# Altium project amplifier.PrjPCB
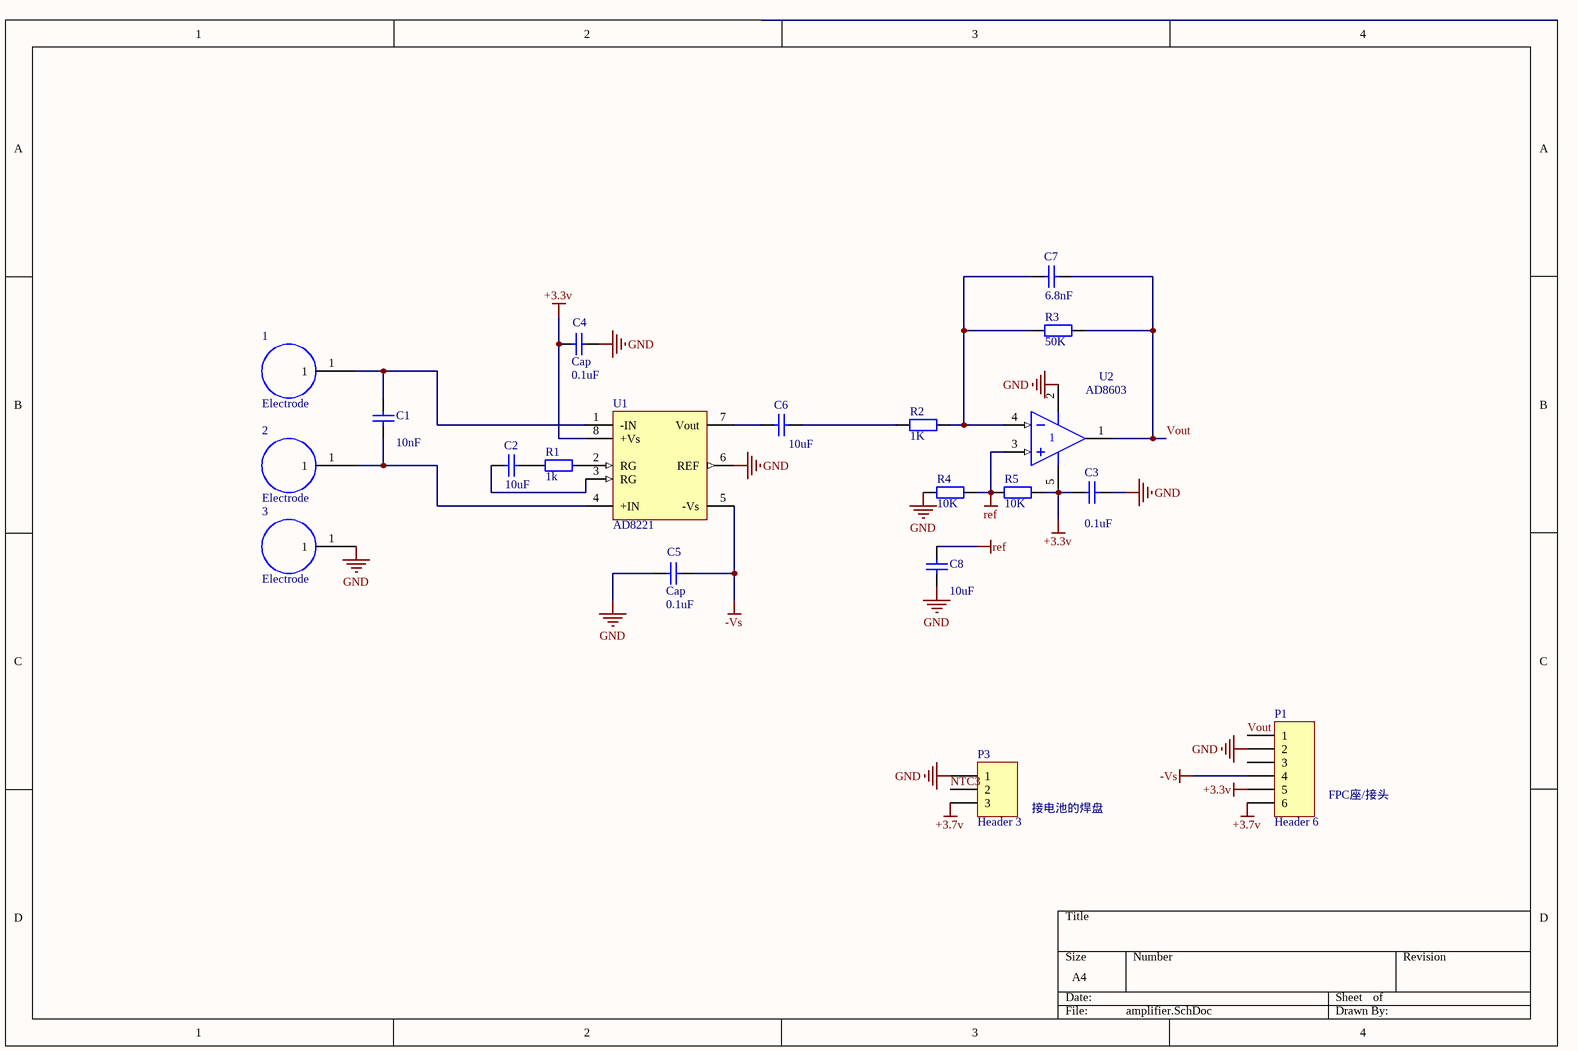
[diagram p0: amplifier.SchDoc]
1 sheet, 20 parts. Net scope: global (net labels, ports and power ports of the same name join across sheets).
Board file: amplifier.PcbDoc

## Sheet amplifier.SchDoc
size A4

### Parts
1  Electrode  [elec-diff]
2  Electrode  [elec-diff]
3  Electrode  [elec-ref]
C1  value 10nF  [1608[0603]]
C2  value 10uF  [1608[0603]]
C3  value 0.1uF  [1608[0603]]
C4  Cap  value 0.1uF  [1608[0603]]
C5  Cap  value 0.1uF  [1608[0603]]
C6  value 10uF  [1608[0603]]
C7  value 6.8nF  [1608[0603]]
C8  value 10uF  [1608[0603]]
P1  Header 6  [6P_0.5mm(FPC) - duplicate]
P3  Header 3  [BAT3]
R1  1k  [1608[0603]]
R2  1K  [1608[0603]]
R3  50K  [1608[0603]]
R4  10K  [1608[0603]]
R5  10K  [1608[0603]]
U1  AD8221  [MSOP-8]
U2  AD8603  [SOT23-5AM]

### Nets
+3.3v: C3.2 C4.1 P1.5 R5.2 U1.8(+Vs) U2.5(V-)
+3.7v: P1.6 P3.3
-Vs: C5.2 P1.4 U1.5(-Vs)
GND: 3.1 C3.1 C4.2 C5.1 C8.1 P1.2 P3.1 R4.1 U1.6(REF) U2.2(V+)
ref: C8.2 R4.2 R5.1 U2.3(IN+)
NTC3: P3.2
Vout: C7.1 P1.1 R3.2 U2.1(OUT)
Net1_1: 1.1 C1.2 U1.1(-IN)
Net2_1: 2.1 C1.1 U1.4(+IN)
NetC2_1: C2.1 R1.2
NetC2_2: C2.2 U1.3(RG)
NetC6_1: C6.1 R2.1
NetC6_2: C6.2 U1.7(Vout)
NetC7_2: C7.2 R2.2 R3.1 U2.4(IN-)
NetR1_1: R1.1 U1.2(RG)

Not connected (* = marked no-connect by the designer): P1 3

### Notes on the sheet
- FPC座/接头
- 接电池的焊盘

### Library data of the parts
C1-C8 = Cap: Capacitor; Published: 8-Jun-2000; LatestRevisionDate: 17-Jul-2002; LatestRevisionNote: Re-released for DXP Platform.; PackageReference: RAD-0.3; Publisher: Altium Limited
P1 = Header 6: Header, 6-Pin; LatestRevisionDate: 17-Jul-2002; LatestRevisionNote: Re-released for DXP Platform.; Publisher: Altium Limited
P3 = Header 3: Header, 3-Pin; LatestRevisionDate: 17-Jul-2002; LatestRevisionNote: Re-released for DXP Platform.; Publisher: Altium Limited
R1-R5 = Res2: Resistor; Published: 8-Jun-2000; LatestRevisionDate: 17-Jul-2002; LatestRevisionNote: Re-released for DXP Platform.; PackageReference: AXIAL-0.4; Publisher: Altium Limited
U1 = INA128UA: Precision, Low-Power Instrumentation Amplifiers; Published: 8-Jun-2000; LatestRevisionDate: 13-Apr-2006; LatestRevisionNote: IPC-7351 Footprint Added.; DatasheetVersion: Oct-1996; PackageReference: 182H; Publisher: Altium Limited; PackageDescription: 8-Pin Small Outline Integrated Circuit 1.27 mm Pitch; Code_JEDEC: MS-012-AA; Code_IPC: SOIC127P600-8; ComponentLink1Description: Manufacturer Link; ComponentLink1URL: http://www.ti.com/; ComponentLink2Description: Datasheet; ComponentLink2URL: http://www-s.ti.com/sc/ds/INA128.pdf